# Altium project Tegra_Dual_Camera.PrjPcb (part 3 of 3)

## Sheet LWIR_FPGA_CSI.SchDoc
size A4
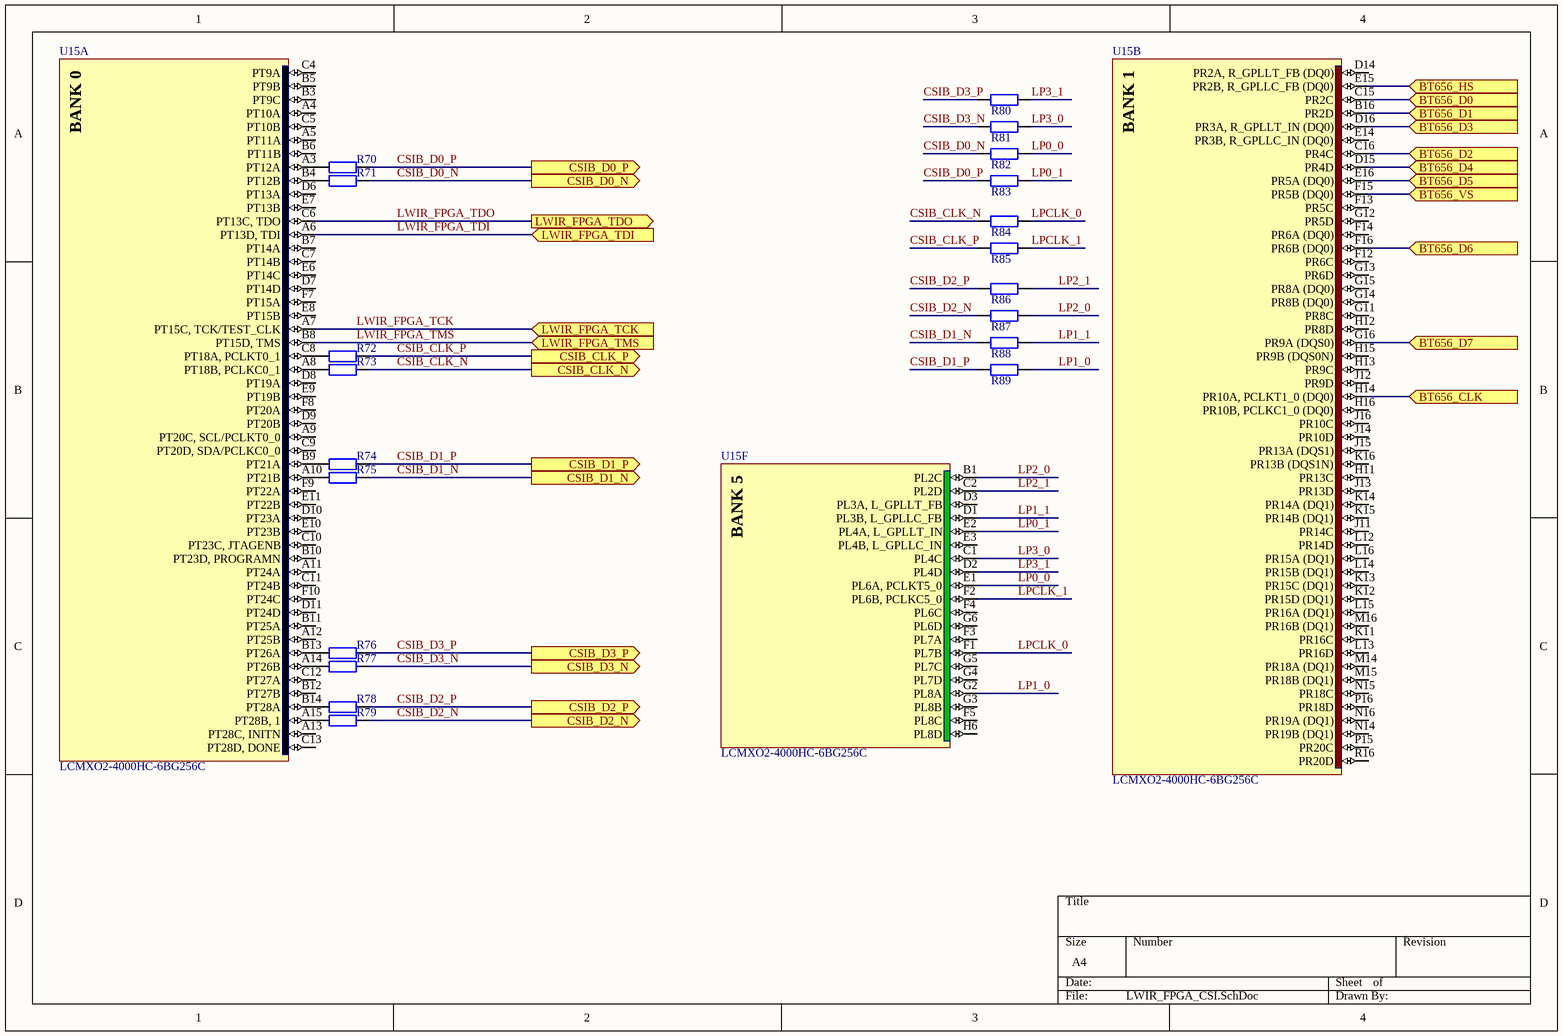
[diagram p10: LWIR_FPGA_CSI.SchDoc]

### Parts
R70  CRCW0402330RFKED  [0402R_M]  (value not drawn)
R71  CRCW0402330RFKED  [0402R_M]  (value not drawn)
R72  CRCW0402330RFKED  [0402R_M]  (value not drawn)
R73  CRCW0402330RFKED  [0402R_M]  (value not drawn)
R74  CRCW0402330RFKED  [0402R_M]  (value not drawn)
R75  CRCW0402330RFKED  [0402R_M]  (value not drawn)
R76  CRCW0402330RFKED  [0402R_M]  (value not drawn)
R77  CRCW0402330RFKED  [0402R_M]  (value not drawn)
R78  CRCW0402330RFKED  [0402R_M]  (value not drawn)
R79  CRCW0402330RFKED  [0402R_M]  (value not drawn)
R80  CRCW040249R9FKED  [0402R_M]  (value not drawn)
R81  CRCW040249R9FKED  [0402R_M]  (value not drawn)
R82  CRCW040249R9FKED  [0402R_M]  (value not drawn)
R83  CRCW040249R9FKED  [0402R_M]  (value not drawn)
R84  CRCW040249R9FKED  [0402R_M]  (value not drawn)
R85  CRCW040249R9FKED  [0402R_M]  (value not drawn)
R86  CRCW040249R9FKED  [0402R_M]  (value not drawn)
R87  CRCW040249R9FKED  [0402R_M]  (value not drawn)
R88  CRCW040249R9FKED  [0402R_M]  (value not drawn)
R89  CRCW040249R9FKED  [0402R_M]  (value not drawn)
U15  LCMXO2-4000HC-6BG256C  [caBGA256]  (parts A,B,F of 8)

### Ports
BT656_CLK (in), BT656_D0 (in), BT656_D1 (in), BT656_D2 (in), BT656_D3 (in), BT656_D4 (in), BT656_D5 (in), BT656_D6 (in), BT656_D7 (in), BT656_HS (in), BT656_VS (in), CSIB_CLK_N (out), CSIB_CLK_P (out), CSIB_D0_N (out), CSIB_D0_P (out), CSIB_D1_N (out), CSIB_D1_P (out), CSIB_D2_N (out), CSIB_D2_P (out), CSIB_D3_N (out), CSIB_D3_P (out), LWIR_FPGA_TCK (in), LWIR_FPGA_TDI (in), LWIR_FPGA_TDO (out), LWIR_FPGA_TMS (in)

### Nets
BT656_CLK: U15.H14(PR10A,_PCLKT1_0_(DQ0)) ; port BT656_CLK
BT656_D0: U15.C15(PR2C) ; port BT656_D0
BT656_D1: U15.B16(PR2D) ; port BT656_D1
BT656_D2: U15.C16(PR4C) ; port BT656_D2
BT656_D3: U15.D16(PR3A,_R_GPLLT_IN_(DQ0)) ; port BT656_D3
BT656_D4: U15.D15(PR4D) ; port BT656_D4
BT656_D5: U15.E16(PR5A_(DQ0)) ; port BT656_D5
BT656_D6: U15.F16(PR6B_(DQ0)) ; port BT656_D6
BT656_D7: U15.G16(PR9A_(DQS0)) ; port BT656_D7
BT656_HS: U15.E15(PR2B,_R_GPLLC_FB_(DQ0)) ; port BT656_HS
BT656_VS: U15.F15(PR5B_(DQ0)) ; port BT656_VS
CSIB_CLK_N: R73.2 R84.1 ; port CSIB_CLK_N
CSIB_CLK_P: R72.2 R85.1 ; port CSIB_CLK_P
CSIB_D0_N: R71.2 R82.1 ; port CSIB_D0_N
CSIB_D0_P: R70.2 R83.1 ; port CSIB_D0_P
CSIB_D1_N: R75.2 R88.2 ; port CSIB_D1_N
CSIB_D1_P: R74.2 R89.2 ; port CSIB_D1_P
CSIB_D2_N: R79.2 R87.2 ; port CSIB_D2_N
CSIB_D2_P: R78.2 R86.2 ; port CSIB_D2_P
CSIB_D3_N: R77.2 R81.1 ; port CSIB_D3_N
CSIB_D3_P: R76.2 R80.1 ; port CSIB_D3_P
LP0_0: R82.2 U15.E1(PL6A,_PCLKT5_0)
LP0_1: R83.2 U15.E2(PL4A,_L_GPLLT_IN)
LP1_0: R89.1 U15.G2(PL8A)
LP1_1: R88.1 U15.D1(PL3B,_L_GPLLC_FB)
LP2_0: R87.1 U15.B1(PL2C)
LP2_1: R86.1 U15.C2(PL2D)
LP3_0: R81.2 U15.C1(PL4C)
LP3_1: R80.2 U15.D2(PL4D)
LPCLK_0: R84.2 U15.F1(PL7B)
LPCLK_1: R85.2 U15.F2(PL6B,_PCLKC5_0)
LWIR_FPGA_TCK: U15.A7(PT15C,_TCK/TEST_CLK) ; port LWIR_FPGA_TCK
LWIR_FPGA_TDI: U15.A6(PT13D,_TDI) ; port LWIR_FPGA_TDI
LWIR_FPGA_TDO: U15.C6(PT13C,_TDO) ; port LWIR_FPGA_TDO
LWIR_FPGA_TMS: U15.B8(PT15D,_TMS) ; port LWIR_FPGA_TMS
NetR70_1: R70.1 U15.A3(PT12A)
NetR71_1: R71.1 U15.B4(PT12B)
NetR72_1: R72.1 U15.C8(PT18A,_PCLKT0_1)
NetR73_1: R73.1 U15.A8(PT18B,_PCLKC0_1)
NetR74_1: R74.1 U15.B9(PT21A)
NetR75_1: R75.1 U15.A10(PT21B)
NetR76_1: R76.1 U15.B13(PT26A)
NetR77_1: R77.1 U15.A14(PT26B)
NetR78_1: R78.1 U15.B14(PT28A)
NetR79_1: R79.1 U15.A15(PT28B,_1)

Not connected (* = marked no-connect by the designer): U15 A4(PT10A) A5(PT11A) A9(PT20C,_SCL/PCLKT0_0) A11(PT24A) A12(PT25B) A13(PT28C,_INITN) B3(PT9C) B5(PT9B) B6(PT11B) B7(PT14A) B10(PT23D,_PROGRAMN) B11(PT25A) B12(PT27B) C4(PT9A) C5(PT10B) C7(PT14B) C9(PT20D,_SDA/PCLKC0_0) C10(PT23C,_JTAGENB) C11(PT24B) C12(PT27A) C13(PT28D,_DONE) D3(PL3A,_L_GPLLT_FB) D6(PT13A) D7(PT14D) D8(PT19A) D9(PT20B) D10(PT23A) D11(PT24D) D14(PR2A,_R_GPLLT_FB_(DQ0)) E3(PL4B,_L_GPLLC_IN) E6(PT14C) E7(PT13B) E8(PT15B) E9(PT19B) E10(PT23B) E11(PT22B) E14(PR3B,_R_GPLLC_IN_(DQ0)) F3(PL7A) F4(PL6C) F5(PL8C) F7(PT15A) F8(PT20A) F9(PT22A) F10(PT24C) F12(PR6C) F13(PR5C) F14(PR6A_(DQ0)) G3(PL8B) G4(PL7D) G5(PL7C) G6(PL6D) G11(PR8C) G12(PR5D) G13(PR6D) G14(PR8B_(DQ0)) G15(PR8A_(DQ0)) H6(PL8D) H11(PR13C) H12(PR8D) H13(PR9C) H15(PR9B_(DQS0N)) H16(PR10B,_PCLKC1_0_(DQ0)) J11(PR14C) J12(PR9D) J13(PR13D) J14(PR10D) J15(PR13A_(DQS1)) J16(PR10C) K11(PR16C) K12(PR15D_(DQ1)) K13(PR15C_(DQ1)) K14(PR14A_(DQ1)) K15(PR14B_(DQ1)) K16(PR13B_(DQS1N)) L12(PR14D) L13(PR16D) L14(PR15B_(DQ1)) L15(PR16A_(DQ1)) L16(PR15A_(DQ1)) M14(PR18A_(DQ1)) M15(PR18B_(DQ1)) M16(PR16B_(DQ1)) N14(PR19B_(DQ1)) N15(PR18C) N16(PR19A_(DQ1)) P15(PR20C) P16(PR18D) R16(PR20D)

### Notes on the sheet
- (in symbol CMP-0111-00181-1, part A) BANK 0
- (in symbol CMP-0111-00181-1, part B) BANK 1
- (in symbol CMP-0111-00181-1, part F) BANK 5

### Library data of the parts
R70-R79 = CRCW0402330RFKED: RES SMD 330 OHM 1% 1/16W 0402; Manufacturer: Vishay Dale; Power (Watts): 0.063W, 1/16W; Temperature Coefficient: ±100ppm/°C; Value: 330R; Supplier 1: Digi-Key; Manufacturer Part Number: CRCW0402330RFKED; RoHS: RoHS Compliant; Category: Resistors; Stock 1: 346239; Pricing 1: 1=0.1, 10=0.037, 100=0.0149, 1000=0.0067, 2500=0.00582, 5000=0.00481 (USD); Packaging: Cut Tape (CT); Part Status: Active; Tolerance: ±1%; Composition: Thick Film; Features: Automotive AEC-Q200; Operating Temperature: -55°C ~ 155°C; Package / Case: 0402 (1005 Metric); Supplier Device Package: 0402; Size / Dimension: 0.039" L x 0.020" W (1.00mm x 0.50mm); Height - Seated (Max): 0.016" (0.40mm); Failure Rate: -; ComponentLink1URL: http://www.vishay.com/docs/20035/dcrcwe3.pdf; ComponentLink1Description: http://www.vishay.com/docs/20035/dcrcwe3.pdf; Supplier Part Number 1: 541-330LCT-ND
R80-R89 = CRCW040249R9FKED: as R66 on sheet Rail_discharge; Supplier 1: Digi-Key; Manufacturer Part Number: CRCW040249R9FKED; RoHS: RoHS Compliant; Category: Resistors; Stock 1: 0; Pricing 1: 1=0.1, 10=0.037, 100=0.0149, 1000=0.0067, 2500=0.00582, 5000=0.00481 (USD); Packaging: Cut Tape (CT); Part Status: Active; Tolerance: ±1%; Composition: Thick Film; Features: Automotive AEC-Q200; Operating Temperature: -55°C ~ 155°C; Package / Case: 0402 (1005 Metric); Supplier Device Package: 0402; Size / Dimension: 0.039" L x 0.020" W (1.00mm x 0.50mm); Height - Seated (Max): 0.016" (0.40mm); Failure Rate: -; ComponentLink1URL: http://www.vishay.com/docs/20035/dcrcwe3.pdf; ComponentLink1Description: http://www.vishay.com/docs/20035/dcrcwe3.pdf; Supplier Part Number 1: 541-49.9LCT-ND
U15 = CMP-0111-00181-1: MachXO2 High Performance CPLD with 4320 LUTs, Voltage Regulator, 2.5V/3.3V, 256-pin caBGA, Speed Grade-6, Commercial Grade, Halogen Free (RoHS); PackageDescription: 256-Ball caBGA Package, 14 x 14 mm Body, 0.8 mm Pitch; DatasheetVersion: ver01.0, Nov-2010; PackageReference: caBGA256; PackageVersion: ver02.6, Nov-2010; Code_JEDEC: MO-275-JJAB-2; PartId: 1

## Sheet LWIR_FPGA_Misc.SchDoc
size A4
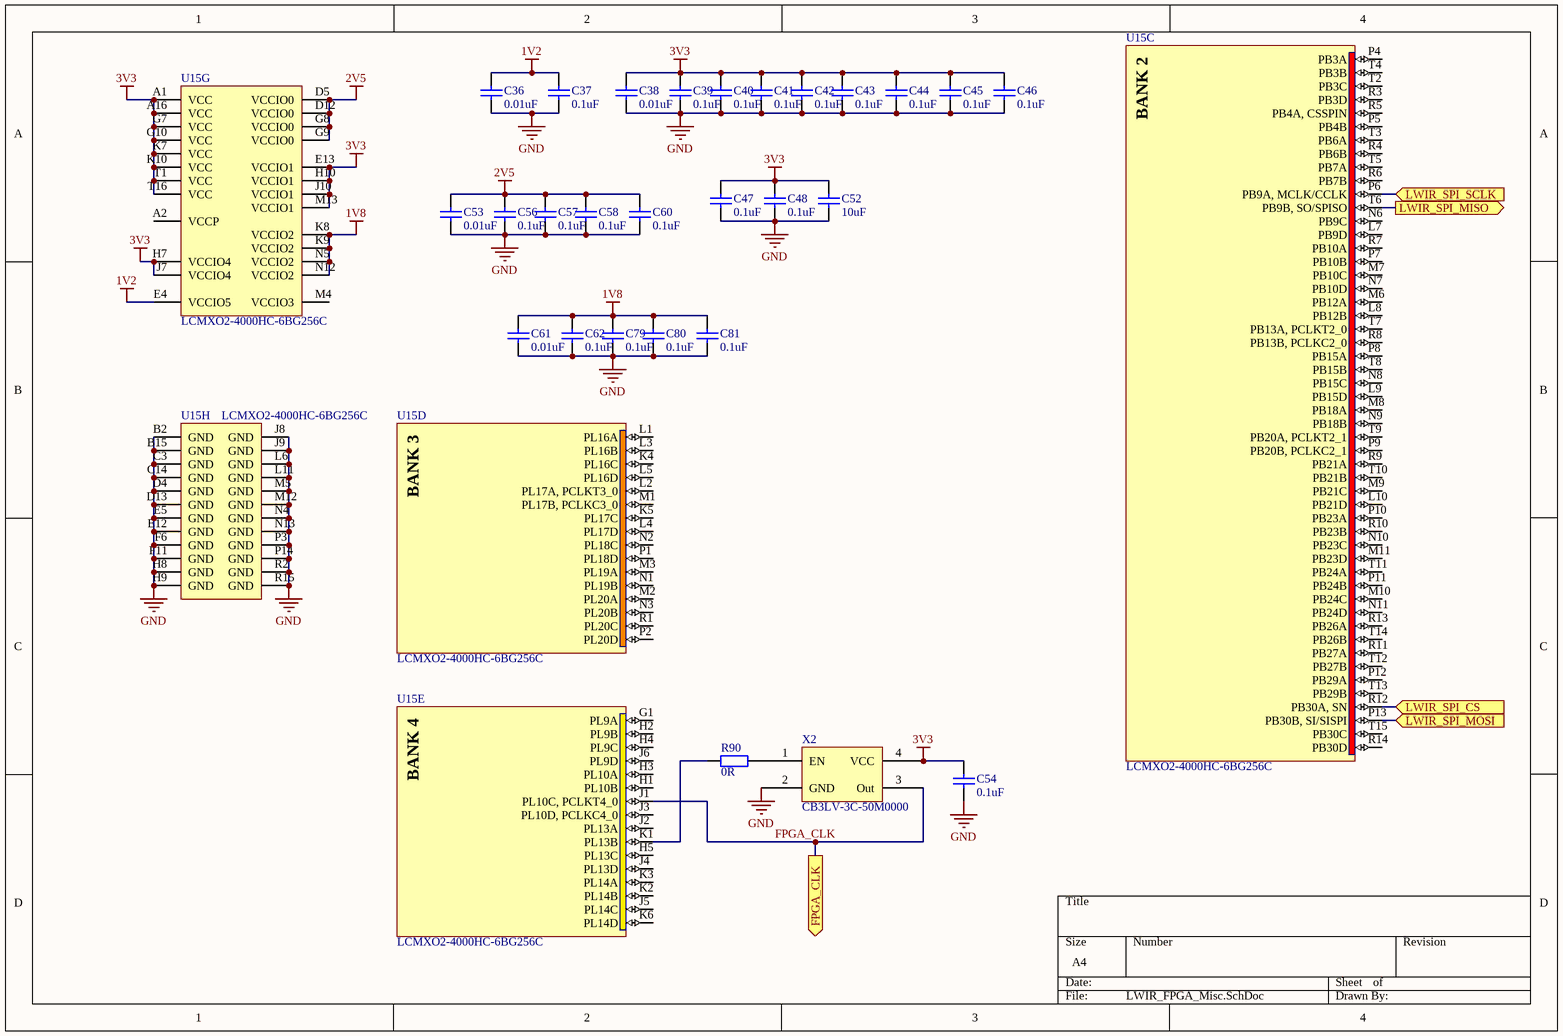
[diagram p11: LWIR_FPGA_Misc.SchDoc]

### Parts
C36  value 0.01uF  [0402C_M]  (hidden comment: GRM155R71H103KA88D)
C37  Capacitance: 0.1uF  [0402C_M]  (hidden comment: GRM155R71C104KA88D)
C38  value 0.01uF  [0402C_M]  (hidden comment: GRM155R71H103KA88D)
C39  Capacitance: 0.1uF  [0402C_M]  (hidden comment: GRM155R71C104KA88D)
C40  Capacitance: 0.1uF  [0402C_M]  (hidden comment: GRM155R71C104KA88D)
C41  Capacitance: 0.1uF  [0402C_M]  (hidden comment: GRM155R71C104KA88D)
C42  Capacitance: 0.1uF  [0402C_M]  (hidden comment: GRM155R71C104KA88D)
C43  Capacitance: 0.1uF  [0402C_M]  (hidden comment: GRM155R71C104KA88D)
C44  Capacitance: 0.1uF  [0402C_M]  (hidden comment: GRM155R71C104KA88D)
C45  Capacitance: 0.1uF  [0402C_M]  (hidden comment: GRM155R71C104KA88D)
C46  Capacitance: 0.1uF  [0402C_M]  (hidden comment: GRM155R71C104KA88D)
C47  Capacitance: 0.1uF  [0402C_M]  (hidden comment: GRM155R71C104KA88D)
C48  Capacitance: 0.1uF  [0402C_M]  (hidden comment: GRM155R71C104KA88D)
C52  value 10uF  [0603C_M]  (hidden comment: GRM188R60J106ME47D)
C53  value 0.01uF  [0402C_M]  (hidden comment: GRM155R71H103KA88D)
C54  Capacitance: 0.1uF  [0402C_M]  (hidden comment: GRM155R71C104KA88D)
C56  Capacitance: 0.1uF  [0402C_M]  (hidden comment: GRM155R71C104KA88D)
C57  Capacitance: 0.1uF  [0402C_M]  (hidden comment: GRM155R71C104KA88D)
C58  Capacitance: 0.1uF  [0402C_M]  (hidden comment: GRM155R71C104KA88D)
C60  Capacitance: 0.1uF  [0402C_M]  (hidden comment: GRM155R71C104KA88D)
C61  value 0.01uF  [0402C_M]  (hidden comment: GRM155R71H103KA88D)
C62  Capacitance: 0.1uF  [0402C_M]  (hidden comment: GRM155R71C104KA88D)
C79  Capacitance: 0.1uF  [0402C_M]  (hidden comment: GRM155R71C104KA88D)
C80  Capacitance: 0.1uF  [0402C_M]  (hidden comment: GRM155R71C104KA88D)
C81  Capacitance: 0.1uF  [0402C_M]  (hidden comment: GRM155R71C104KA88D)
R90  value 0R  [0402R_M]  (hidden comment: Generic resitor)
U15  LCMXO2-4000HC-6BG256C  [caBGA256]  (parts C,D,E,G,H of 8)
X2  CB3LV-3C-50M0000  [CB3LV-3C-50M0000]

### Ports
FPGA_CLK (out), LWIR_SPI_CS (in), LWIR_SPI_MISO (out), LWIR_SPI_MOSI (in), LWIR_SPI_SCLK (in)

### Nets
1V2: C36.2 C37.2 U15.E4(VCCIO5)
1V8: C61.2 C62.2 C79.2 C80.2 C81.2 U15.K8(VCCIO2) U15.K9(VCCIO2) U15.N5(VCCIO2) U15.N12(VCCIO2)
2V5: C53.2 C56.2 C57.2 C58.2 C60.2 U15.D5(VCCIO0) U15.D12(VCCIO0) U15.G8(VCCIO0) U15.G9(VCCIO0)
3V3: C38.2 C39.2 C40.2 C41.2 C42.2 C43.2 C44.2 C45.2 C46.2 C47.2 C48.2 C52.2 C54.2 U15.A1(VCC) U15.A16(VCC) U15.E13(VCCIO1) U15.G7(VCC) U15.G10(VCC) U15.H7(VCCIO4) U15.H10(VCCIO1) U15.J7(VCCIO4) U15.J10(VCCIO1) U15.K7(VCC) U15.K10(VCC) U15.M13(VCCIO1) U15.T1(VCC) U15.T16(VCC) X2.4(VCC)
GND: C36.1 C37.1 C38.1 C39.1 C40.1 C41.1 C42.1 C43.1 C44.1 C45.1 C46.1 C47.1 C48.1 C52.1 C53.1 C54.1 C56.1 C57.1 C58.1 C60.1 C61.1 C62.1 C79.1 C80.1 C81.1 U15.B2(GND) U15.B15(GND) U15.C3(GND) U15.C14(GND) U15.D4(GND) U15.D13(GND) U15.E5(GND) U15.E12(GND) U15.F6(GND) U15.F11(GND) U15.H8(GND) U15.H9(GND) U15.J8(GND) U15.J9(GND) U15.L6(GND) U15.L11(GND) U15.M5(GND) U15.M12(GND) U15.N4(GND) U15.N13(GND) U15.P3(GND) U15.P14(GND) U15.R2(GND) U15.R15(GND) X2.2(GND)
FPGA_CLK: U15.J1(PL10C,_PCLKT4_0) X2.3(Out) ; port FPGA_CLK
LWIR_SPI_CS: U15.R12(PB30A,_SN) ; port LWIR_SPI_CS
LWIR_SPI_MISO: U15.T6(PB9B,_SO/SPISO) ; port LWIR_SPI_MISO
LWIR_SPI_MOSI: U15.P13(PB30B,_SI/SISPI) ; port LWIR_SPI_MOSI
LWIR_SPI_SCLK: U15.P6(PB9A,_MCLK/CCLK) ; port LWIR_SPI_SCLK
NetR90_1: R90.1 U15.K1(PL13B)
NetR90_2: R90.2 X2.1(EN)

Not connected (* = marked no-connect by the designer): U15 A2(VCCP) G1(PL9A) H1(PL10B) H2(PL9B) H3(PL10A) H4(PL9C) H5(PL13C) J2(PL13A) J3(PL10D,_PCLKC4_0) J4(PL13D) J5(PL14C) J6(PL9D) K2(PL14B) K3(PL14A) K4(PL16C) K5(PL17C) K6(PL14D) L1(PL16A) L2(PL17A,_PCLKT3_0) L3(PL16B) L4(PL17D) L5(PL16D) L7(PB9D) L8(PB12B) L9(PB15D) L10(PB21D) M1(PL17B,_PCLKC3_0) M2(PL20A) M3(PL19A) M4(VCCIO3) M6(PB12A) M7(PB10C) M8(PB18A) M9(PB21C) M10(PB24C) M11(PB23D) N1(PL19B) N2(PL18C) N3(PL20B) N6(PB9C) N7(PB10D) N8(PB15C) N9(PB18B) N10(PB23C) N11(PB24D) P1(PL18D) P2(PL20D) P4(PB3A) P5(PB4B) P7(PB10B) P8(PB15A) P9(PB20B,_PCLKC2_1) P10(PB23A) P11(PB24B) P12(PB29A) R1(PL20C) R3(PB3D) R4(PB6B) R5(PB4A,_CSSPIN) R6(PB7B) R7(PB10A) R8(PB13B,_PCLKC2_0) R9(PB21A) R10(PB23B) R11(PB27A) R13(PB26A) R14(PB30D) T2(PB3C) T3(PB6A) T4(PB3B) T5(PB7A) T7(PB13A,_PCLKT2_0) T8(PB15B) T9(PB20A,_PCLKT2_1) T10(PB21B) T11(PB24A) T12(PB27B) T13(PB29B) T14(PB26B) T15(PB30C)

### Notes on the sheet
- (in symbol CMP-0111-00181-1, part C) BANK 2
- (in symbol CMP-0111-00181-1, part D) BANK 3
- (in symbol CMP-0111-00181-1, part E) BANK 4

### Library data of the parts
C36 C38 C53 C61 = GRM155R71H103KA88D: as C2 on sheet Ethernet; Supplier 1: Digi-Key; Manufacturer Part Number: GRM155R71H103KA88D; RoHS: RoHS Compliant; Category: Capacitors; Stock 1: 10436079; Pricing 1: 1=0.1, 10=0.011, 100=0.005, 500=0.00354, 1000=0.00278, 2500=0.00253, 5000=0.00233 (USD); Packaging: Cut Tape (CT); Part Status: Active; Voltage - Rated: 50V; Temperature Coefficient: X7R; Operating Temperature: -55°C ~ 125°C; Features: -; Ratings: -; Applications: General Purpose; Mounting Type: Surface Mount, MLCC; Package / Case: 0402 (1005 Metric); Size / Dimension: 0.039" L x 0.020" W (1.00mm x 0.50mm); Height - Seated (Max): -; Thickness (Max): 0.022" (0.55mm); Lead Spacing: -; Lead Style: -; ComponentLink1URL: http://www.murata.com/~/media/webrenewal/support/library/catalog/products/capacitor/mlcc/c02e.pdf; ComponentLink1Description: http://www.murata.com/~/media/webrenewal/support/library/catalog/products/capacitor/mlcc/c02e.pdf; Supplier Part Number 1: 490-4516-1-ND
C37 C39-C48 C54 C56-C58 C60 C62 C79-C81 = GRM155R71C104KA88D: as C19 on sheet SD_Card; Supplier 1: Digi-Key; Manufacturer Part Number: GRM155R71C104KA88D; RoHS: RoHS Compliant; Category: Capacitors; Stock 1: 58190082; Pricing 1: 1=0.1, 10=0.013, 100=0.0059, 500=0.00422, 1000=0.00332, 2500=0.00302, 5000=0.00278 (USD); Packaging: Cut Tape (CT); Part Status: Active; Voltage - Rated: 16V; Temperature Coefficient: X7R; Operating Temperature: -55°C ~ 125°C; Features: -; Ratings: -; Applications: General Purpose; Mounting Type: Surface Mount, MLCC; Package / Case: 0402 (1005 Metric); Size / Dimension: 0.039" L x 0.020" W (1.00mm x 0.50mm); Height - Seated (Max): -; Thickness (Max): 0.022" (0.55mm); Lead Spacing: -; Lead Style: -; ComponentLink1URL: http://www.murata.com/~/media/webrenewal/support/library/catalog/products/capacitor/mlcc/c02e.ashx; ComponentLink1Description: http://www.murata.com/~/media/webrenewal/support/library/catalog/products/capacitor/mlcc/c02e.ashx; Supplier Part Number 1: 490-3261-1-ND
C52 = GRM188R60J106ME47D: as C4 on sheet Power; Supplier 1: Digi-Key; Manufacturer Part Number: GRM188R60J106ME47D; RoHS: RoHS Compliant; Category: Capacitors; Stock 1: 13697850; Pricing 1: 1=0.17, 10=0.123, 100=0.0578, 500=0.04052, 1000=0.03355 (USD); Packaging: Cut Tape (CT); Part Status: Active; Voltage - Rated: 6.3V; Temperature Coefficient: X5R; Operating Temperature: -55°C ~ 85°C; Features: -; Ratings: -; Applications: General Purpose; Mounting Type: Surface Mount, MLCC; Package / Case: 0603 (1608 Metric); Size / Dimension: 0.063" L x 0.031" W (1.60mm x 0.80mm); Height - Seated (Max): -; Thickness (Max): 0.035" (0.90mm); Lead Spacing: -; Lead Style: -; ComponentLink1URL: http://www.murata.com/~/media/webrenewal/support/library/catalog/products/capacitor/mlcc/c02e.pdf; ComponentLink1Description: http://www.murata.com/~/media/webrenewal/support/library/catalog/products/capacitor/mlcc/c02e.pdf; Supplier Part Number 1: 490-3896-1-ND
R90 = Resistor
U15 = CMP-0111-00181-1: as U15 on sheet LWIR_FPGA_CSI; PackageDescription: 256-Ball caBGA Package, 14 x 14 mm Body, 0.8 mm Pitch; DatasheetVersion: ver01.0, Nov-2010; PackageReference: caBGA256; PackageVersion: ver02.6, Nov-2010; Code_JEDEC: MO-275-JJAB-2; PartId: 1
X2 = CB3LV-3C-50M0000: OSC XO 50.000MHZ HCMOS TTL SMD; Manufacturer: CTS-Frequency Controls; Function: Enable/Disable; Output: HCMOS, TTL; Voltage - Supply: 3.3V; Frequency Stability: ±50ppm; Current - Supply (Max): 40mA; Current - Supply (Disable) (Max): 10µA; Supplier 1: Digi-Key; Manufacturer Part Number: CB3LV-3C-50M0000; RoHS: RoHS Compliant; Category: Crystals, Oscillators, Resonators; Stock 1: 20256; Pricing 1: 1=1.41, 10=1.35, 50=1.319, 100=1.1306, 500=1.09918 (USD); Packaging: Cut Tape (CT); Part Status: Active; Type: XO (Standard); Operating Temperature: -20°C ~ 70°C; Ratings: -; Mounting Type: Surface Mount; Package / Case: 4-SMD, No Lead; Size / Dimension: 0.276" L x 0.197" W (7.00mm x 5.00mm); Height - Seated (Max): 0.071" (1.80mm); ComponentLink1URL: http://www.ctscorp.com/wp-content/uploads/2015/11/008-0256-0.pdf; ComponentLink1Description: http://www.ctscorp.com/wp-content/uploads/2015/11/008-0256-0.pdf; Supplier Part Number 1: CTX283LVCT-ND

## Sheet RGB_Camera.SchDoc
size A4
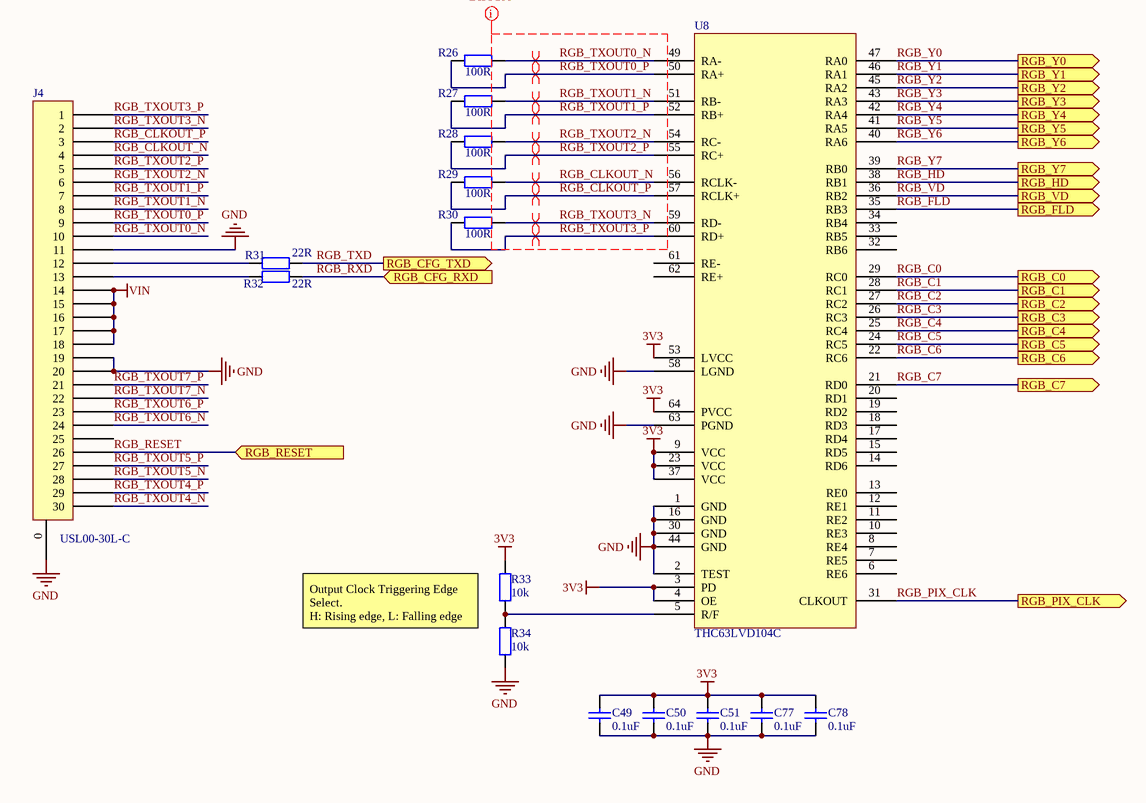
[diagram p12: RGB_Camera.SchDoc]

### Parts
C49  Capacitance: 0.1uF  [0402C_M]  (hidden comment: GRM155R71C104KA88D)
C50  Capacitance: 0.1uF  [0402C_M]  (hidden comment: GRM155R71C104KA88D)
C51  Capacitance: 0.1uF  [0402C_M]  (hidden comment: GRM155R71C104KA88D)
C77  Capacitance: 0.1uF  [0402C_M]  (hidden comment: GRM155R71C104KA88D)
C78  Capacitance: 0.1uF  [0402C_M]  (hidden comment: GRM155R71C104KA88D)
J4  USL00-30L-C  [USL00-30L-C]
R26  value 100R  [0402R_M]  (hidden comment: CRCW0402100RFKEE)
R27  value 100R  [0402R_M]  (hidden comment: CRCW0402100RFKEE)
R28  value 100R  [0402R_M]  (hidden comment: CRCW0402100RFKEE)
R29  value 100R  [0402R_M]  (hidden comment: CRCW0402100RFKEE)
R30  value 100R  [0402R_M]  (hidden comment: CRCW0402100RFKEE)
R31  Resistance: 22R  [0402R_M]  (hidden comment: CRCW040222R0JNED)
R32  Resistance: 22R  [0402R_M]  (hidden comment: CRCW040222R0JNED)
R33  value 10k  [0402R_M]  (hidden comment: CRCW040210K0FKED)
R34  value 10k  [0402R_M]  (hidden comment: CRCW040210K0FKED)
U8  THC63LVD104C  [THC_LQFP64_L]

### Ports
RGB_C0 (out), RGB_C1 (out), RGB_C2 (out), RGB_C3 (out), RGB_C4 (out), RGB_C5 (out), RGB_C6 (out), RGB_C7 (out), RGB_CFG_RXD (in), RGB_CFG_TXD (out), RGB_FLD (out), RGB_HD (out), RGB_PIX_CLK (out), RGB_RESET (in), RGB_VD (out), RGB_Y0 (out), RGB_Y1 (out), RGB_Y2 (out), RGB_Y3 (out), RGB_Y4 (out), RGB_Y5 (out), RGB_Y6 (out), RGB_Y7 (out)

### Nets
3V3: C49.2 C50.2 C51.2 C77.2 C78.2 R33.2 U8.3(PD) U8.4(OE) U8.9(VCC) U8.23(VCC) U8.37(VCC) U8.53(LVCC) U8.64(PVCC)
GND: C49.1 C50.1 C51.1 C77.1 C78.1 J4.0 J4.11 J4.19 J4.20 R34.1 U8.1(GND) U8.2(TEST) U8.16(GND) U8.30(GND) U8.44(GND) U8.58(LGND) U8.63(PGND)
VIN: J4.14 J4.15 J4.16 J4.17 J4.18
RGB_C0: U8.29(RC0) ; port RGB_C0
RGB_C1: U8.28(RC1) ; port RGB_C1
RGB_C2: U8.27(RC2) ; port RGB_C2
RGB_C3: U8.26(RC3) ; port RGB_C3
RGB_C4: U8.25(RC4) ; port RGB_C4
RGB_C5: U8.24(RC5) ; port RGB_C5
RGB_C6: U8.22(RC6) ; port RGB_C6
RGB_C7: U8.21(RD0) ; port RGB_C7
RGB_CLKOUT_N: J4.4 R29.2 U8.56(RCLK-)
RGB_CLKOUT_P: J4.3 R29.1 U8.57(RCLK+)
RGB_FLD: U8.35(RB3) ; port RGB_FLD
RGB_HD: U8.38(RB1) ; port RGB_HD
RGB_PIX_CLK: U8.31(CLKOUT) ; port RGB_PIX_CLK
RGB_RESET: J4.26 ; port RGB_RESET
RGB_RXD: R32.2 ; port RGB_CFG_RXD
RGB_TXD: R31.2 ; port RGB_CFG_TXD
RGB_TXOUT0_N: J4.10 R26.2 U8.49(RA-)
RGB_TXOUT0_P: J4.9 R26.1 U8.50(RA+)
RGB_TXOUT1_N: J4.8 R27.2 U8.51(RB-)
RGB_TXOUT1_P: J4.7 R27.1 U8.52(RB+)
RGB_TXOUT2_N: J4.6 R28.2 U8.54(RC-)
RGB_TXOUT2_P: J4.5 R28.1 U8.55(RC+)
RGB_TXOUT3_N: J4.2 R30.2 U8.59(RD-)
RGB_TXOUT3_P: J4.1 R30.1 U8.60(RD+)
RGB_TXOUT4_N: J4.30
RGB_TXOUT4_P: J4.29
RGB_TXOUT5_N: J4.28
RGB_TXOUT5_P: J4.27
RGB_TXOUT6_N: J4.24
RGB_TXOUT6_P: J4.23
RGB_TXOUT7_N: J4.22
RGB_TXOUT7_P: J4.21
RGB_VD: U8.36(RB2) ; port RGB_VD
RGB_Y0: U8.47(RA0) ; port RGB_Y0
RGB_Y1: U8.46(RA1) ; port RGB_Y1
RGB_Y2: U8.45(RA2) ; port RGB_Y2
RGB_Y3: U8.43(RA3) ; port RGB_Y3
RGB_Y4: U8.42(RA4) ; port RGB_Y4
RGB_Y5: U8.41(RA5) ; port RGB_Y5
RGB_Y6: U8.40(RA6) ; port RGB_Y6
RGB_Y7: U8.39(RB0) ; port RGB_Y7
NetJ4_12: J4.12 R31.1
NetJ4_13: J4.13 R32.1
NetR33_1: R33.1 R34.2 U8.5(R/F)

Not connected (* = marked no-connect by the designer): J4 25; U8 6(RE6) 7(RE5) 8(RE4) 10(RE3) 11(RE2) 12(RE1) 13(RE0) 14(RD6) 15(RD5) 17(RD4) 18(RD3) 19(RD2) 20(RD1) 32(RB6) 33(RB5) 34(RB4) 61(RE-) 62(RE+)

### Layout directives
differential pair: RGB_CLKOUT_N, RGB_CLKOUT_P, RGB_TXOUT0_N, RGB_TXOUT0_P, RGB_TXOUT1_N, RGB_TXOUT1_P, RGB_TXOUT2_N, RGB_TXOUT2_P, RGB_TXOUT3_N, RGB_TXOUT3_P
net class DIFF100: RGB_CLKOUT_N, RGB_CLKOUT_P, RGB_TXOUT0_N, RGB_TXOUT0_P, RGB_TXOUT1_N, RGB_TXOUT1_P, RGB_TXOUT2_N, RGB_TXOUT2_P, RGB_TXOUT3_N, RGB_TXOUT3_P

### Notes on the sheet
- Output Clock Triggering Edge Select.
  H: Rising edge, L: Falling edge

### Library data of the parts
C49-C51 C77 C78 = GRM155R71C104KA88D: as C19 on sheet SD_Card; Supplier 1: Digi-Key; Manufacturer Part Number: GRM155R71C104KA88D; RoHS: RoHS Compliant; Category: Capacitors; Stock 1: 58190082; Pricing 1: 1=0.1, 10=0.013, 100=0.0059, 500=0.00422, 1000=0.00332, 2500=0.00302, 5000=0.00278 (USD); Packaging: Cut Tape (CT); Part Status: Active; Voltage - Rated: 16V; Temperature Coefficient: X7R; Operating Temperature: -55°C ~ 125°C; Features: -; Ratings: -; Applications: General Purpose; Mounting Type: Surface Mount, MLCC; Package / Case: 0402 (1005 Metric); Size / Dimension: 0.039" L x 0.020" W (1.00mm x 0.50mm); Height - Seated (Max): -; Thickness (Max): 0.022" (0.55mm); Lead Spacing: -; Lead Style: -; ComponentLink1URL: http://www.murata.com/~/media/webrenewal/support/library/catalog/products/capacitor/mlcc/c02e.ashx; ComponentLink1Description: http://www.murata.com/~/media/webrenewal/support/library/catalog/products/capacitor/mlcc/c02e.ashx; Supplier Part Number 1: 490-3261-1-ND
R26-R30 = CRCW0402100RFKEE: RES SMD 100 OHM 1% 1/16W 0402; Manufacturer: Vishay Dale; Power (Watts): 0.063W, 1/16W; Temperature Coefficient: ±100ppm/°C; Supplier 1: Digi-Key; Manufacturer Part Number: CRCW0402100RFKEE; RoHS: RoHS Compliant; Category: Resistors; Stock 1: 2176; Pricing 1: 1=0.1, 10=0.037, 100=0.0149, 1000=0.0067, 2500=0.00582, 5000=0.00481 (USD); Packaging: Cut Tape (CT); Part Status: Active; Tolerance: ±1%; Composition: Thick Film; Features: Automotive AEC-Q200; Operating Temperature: -55°C ~ 155°C; Package / Case: 0402 (1005 Metric); Supplier Device Package: 0402; Size / Dimension: 0.039" L x 0.020" W (1.00mm x 0.50mm); Height - Seated (Max): 0.016" (0.40mm); Failure Rate: -; ComponentLink1URL: http://www.vishay.com/docs/20035/dcrcwe3.pdf; ComponentLink1Description: http://www.vishay.com/docs/20035/dcrcwe3.pdf; Supplier Part Number 1: 541-2953-1-ND
R31 R32 = CRCW040222R0JNED: RES SMD 22 OHM 5% 1/16W 0402; Manufacturer: Vishay / Dale; Power Rating: 63 mW; Temperature Coefficient: 200 PPM / K; Voltage Rating: 50 V; Unit Weight: 0.000023 oz; Supplier 1: Digi-Key; Manufacturer Part Number: CRCW040222R0JNED; Stock 1: 238592; Pricing 1: 1=0.1, 10=0.025, 100=0.01, 1000=0.0045, 2500=0.0039, 5000=0.0032 (USD); Product Category: Thick Film Resistors - SMD; RoHS: Details; Brand: Vishay / Dale; Tolerance: 5 %; Case Code - in: 0402; Case Code - mm: 1005; Operating Temperature Range: - 55 C to + 155 C; Series: CRCW; Height: 0.35 mm; Length: 1 mm; Package / Case: 0402 (1005 metric); Packaging: Reel; Product: Thick Film Resistors SMD; Factory Pack Quantity: 10000; Termination Style: SMD/SMT; Width: 0.5 mm; ComponentLink1URL: https://datasheet.ciiva.com/16429/dcrcwe3-16429946.pdf; ComponentLink1Description: https://datasheet.ciiva.com/16429/dcrcwe3-16429946.pdf; ComponentLink2URL: https://datasheet.ciiva.com/8882/dcrcwe3-8882922.pdf; ComponentLink2Description: https://datasheet.ciiva.com/8882/dcrcwe3-8882922.pdf; ComponentLink3URL: https://datasheet.ciiva.com/16770/70201119-16770509.pdf; ComponentLink3Description: https://datasheet.ciiva.com/16770/70201119-16770509.pdf; ComponentLink4URL: https://datasheet.ciiva.com/3256/dcrcwe3-3256251.pdf; ComponentLink4Description: https://datasheet.ciiva.com/3256/dcrcwe3-3256251.pdf; ComponentLink5URL: https://datasheet.ciiva.com/2462/dcrcwe3-2462055.pdf; ComponentLink5Description: https://datasheet.ciiva.com/2462/dcrcwe3-2462055.pdf; ComponentLink6URL: https://datasheet.ciiva.com/7743/dcrcwe3-7743525.pdf; ComponentLink6Description: https://datasheet.ciiva.com/7743/dcrcwe3-7743525.pdf; ComponentLink7URL: https://datasheet.ciiva.com/2462/dcrcwe3-2462057.pdf; ComponentLink7Description: https://datasheet.ciiva.com/2462/dcrcwe3-2462057.pdf; ComponentLink8URL: https://datasheet.ciiva.com/2462/dcrcwe3-2462056.pdf; ComponentLink8Description: https://datasheet.ciiva.com/2462/dcrcwe3-2462056.pdf; Supplier Part Number 1: 541-22JCT-ND
R33 R34 = CRCW040210K0FKED: RES SMD 10K OHM 1% 1/16W 0402; Manufacturer: Vishay Dale; Power (Watts): 0.063W, 1/16W; Temperature Coefficient: ±100ppm/°C; Supplier 1: Digi-Key; Manufacturer Part Number: CRCW040210K0FKED; RoHS: RoHS Compliant; Category: Resistors; Stock 1: 0; Pricing 1: 1=0.1, 10=0.037, 100=0.0149, 1000=0.0067, 2500=0.00582, 5000=0.00481 (USD); Packaging: Cut Tape (CT); Part Status: Active; Tolerance: ±1%; Composition: Thick Film; Features: Automotive AEC-Q200; Operating Temperature: -55°C ~ 155°C; Package / Case: 0402 (1005 Metric); Supplier Device Package: 0402; Size / Dimension: 0.039" L x 0.020" W (1.00mm x 0.50mm); Height - Seated (Max): 0.016" (0.40mm); Failure Rate: -; ComponentLink1URL: http://www.vishay.com/docs/20035/dcrcwe3.pdf; ComponentLink1Description: http://www.vishay.com/docs/20035/dcrcwe3.pdf; Supplier Part Number 1: 541-10.0KLCT-ND
U8 = THC63LVD104C: IC DESERIALIZER SNGL LVDS 64TQFP; Manufacturer: CEL; Data Rate: 784Mbps; Output Type: CMOS/TTL; Number of Inputs: 5; Number of Outputs: 35; Voltage - Supply: 3 V ~ 3.6 V; Supplier 1: Digi-Key; Manufacturer Part Number: THC63LVD104C; RoHS: RoHS Compliant; Category: Integrated Circuits (ICs); Stock 1: 1654; Pricing 1: 1=12.28, 10=11.048, 25=10.0656, 100=9.0835, 250=8.347, 500=7.6105, 1000=6.6285 (USD); Packaging: Tray; Part Status: Active; Function: Deserializer; Input Type: LVDS; Operating Temperature: -20°C ~ 85°C (TA); Mounting Type: Surface Mount; Package / Case: 64-TQFP; Supplier Device Package: 64-TQFP (10x10); ComponentLink1URL: http://www.cel.com/pdf/datasheets/THC63LVD104C.pdf; ComponentLink1Description: http://www.cel.com/pdf/datasheets/THC63LVD104C.pdf; Supplier Part Number 1: THC63LVD104C-ND

## Sheet RGB_FPGA_CSI.SchDoc
size A4
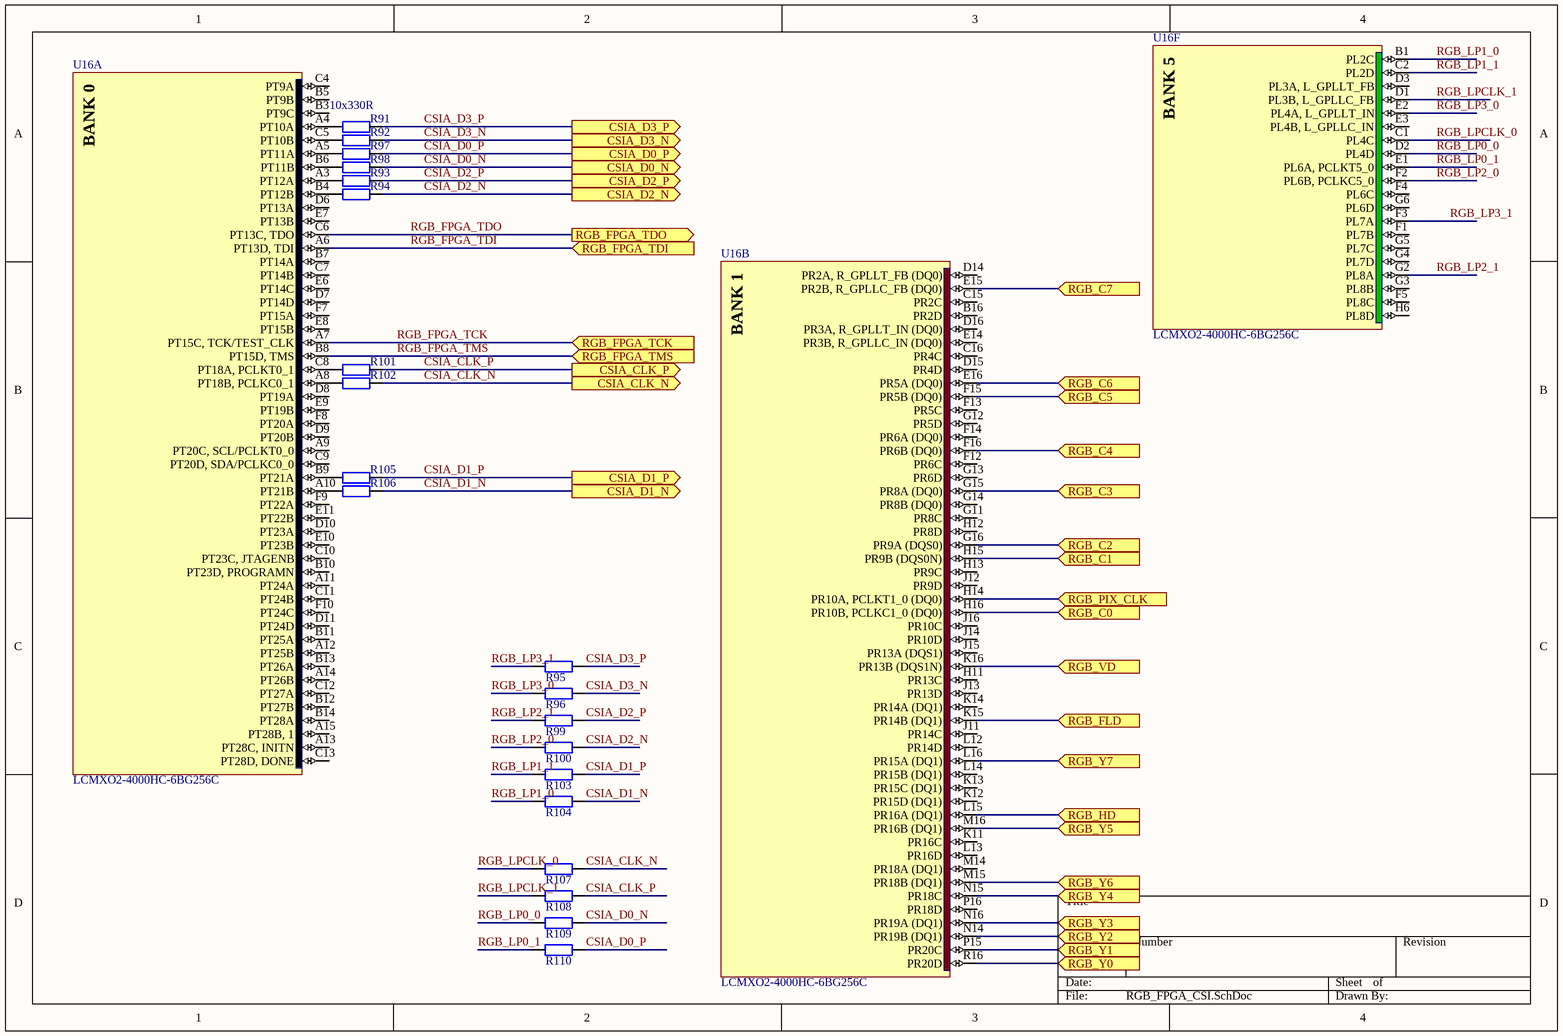
[diagram p13: RGB_FPGA_CSI.SchDoc]

### Parts
R91  CRCW0402330RFKED  [0402R_M]  (value not drawn)
R92  CRCW0402330RFKED  [0402R_M]  (value not drawn)
R93  CRCW0402330RFKED  [0402R_M]  (value not drawn)
R94  CRCW0402330RFKED  [0402R_M]  (value not drawn)
R95  CRCW040249R9FKED  [0402R_M]  (value not drawn)
R96  CRCW040249R9FKED  [0402R_M]  (value not drawn)
R97  CRCW0402330RFKED  [0402R_M]  (value not drawn)
R98  CRCW0402330RFKED  [0402R_M]  (value not drawn)
R99  CRCW040249R9FKED  [0402R_M]  (value not drawn)
R100  CRCW040249R9FKED  [0402R_M]  (value not drawn)
R101  CRCW0402330RFKED  [0402R_M]  (value not drawn)
R102  CRCW0402330RFKED  [0402R_M]  (value not drawn)
R103  CRCW040249R9FKED  [0402R_M]  (value not drawn)
R104  CRCW040249R9FKED  [0402R_M]  (value not drawn)
R105  CRCW0402330RFKED  [0402R_M]  (value not drawn)
R106  CRCW0402330RFKED  [0402R_M]  (value not drawn)
R107  CRCW040249R9FKED  [0402R_M]  (value not drawn)
R108  CRCW040249R9FKED  [0402R_M]  (value not drawn)
R109  CRCW040249R9FKED  [0402R_M]  (value not drawn)
R110  CRCW040249R9FKED  [0402R_M]  (value not drawn)
U16  LCMXO2-4000HC-6BG256C  [caBGA256]  (parts A,B,F of 8)

### Ports
CSIA_CLK_N (out), CSIA_CLK_P (out), CSIA_D0_N (out), CSIA_D0_P (out), CSIA_D1_N (out), CSIA_D1_P (out), CSIA_D2_N (out), CSIA_D2_P (out), CSIA_D3_N (out), CSIA_D3_P (out), RGB_C0 (in), RGB_C1 (in), RGB_C2 (in), RGB_C3 (in), RGB_C4 (in), RGB_C5 (in), RGB_C6 (in), RGB_C7 (in), RGB_FLD (in), RGB_FPGA_TCK (in), RGB_FPGA_TDI (in), RGB_FPGA_TDO (out), RGB_FPGA_TMS (in), RGB_HD (in), RGB_PIX_CLK (in), RGB_VD (in), RGB_Y0 (in), RGB_Y1 (in), RGB_Y2 (in), RGB_Y3 (in), RGB_Y4 (in), RGB_Y5 (in), RGB_Y6 (in), RGB_Y7 (in)

### Nets
CSIA_CLK_N: R102.2 R107.2 ; port CSIA_CLK_N
CSIA_CLK_P: R101.2 R108.2 ; port CSIA_CLK_P
CSIA_D0_N: R98.2 R109.2 ; port CSIA_D0_N
CSIA_D0_P: R97.2 R110.2 ; port CSIA_D0_P
CSIA_D1_N: R104.1 R106.2 ; port CSIA_D1_N
CSIA_D1_P: R103.1 R105.2 ; port CSIA_D1_P
CSIA_D2_N: R94.2 R100.1 ; port CSIA_D2_N
CSIA_D2_P: R93.2 R99.1 ; port CSIA_D2_P
CSIA_D3_N: R92.2 R96.1 ; port CSIA_D3_N
CSIA_D3_P: R91.2 R95.1 ; port CSIA_D3_P
RGB_C0: U16.H16(PR10B,_PCLKC1_0_(DQ0)) ; port RGB_C0
RGB_C1: U16.H15(PR9B_(DQS0N)) ; port RGB_C1
RGB_C2: U16.G16(PR9A_(DQS0)) ; port RGB_C2
RGB_C3: U16.G15(PR8A_(DQ0)) ; port RGB_C3
RGB_C4: U16.F16(PR6B_(DQ0)) ; port RGB_C4
RGB_C5: U16.F15(PR5B_(DQ0)) ; port RGB_C5
RGB_C6: U16.E16(PR5A_(DQ0)) ; port RGB_C6
RGB_C7: U16.E15(PR2B,_R_GPLLC_FB_(DQ0)) ; port RGB_C7
RGB_FLD: U16.K15(PR14B_(DQ1)) ; port RGB_FLD
RGB_FPGA_TCK: U16.A7(PT15C,_TCK/TEST_CLK) ; port RGB_FPGA_TCK
RGB_FPGA_TDI: U16.A6(PT13D,_TDI) ; port RGB_FPGA_TDI
RGB_FPGA_TDO: U16.C6(PT13C,_TDO) ; port RGB_FPGA_TDO
RGB_FPGA_TMS: U16.B8(PT15D,_TMS) ; port RGB_FPGA_TMS
RGB_HD: U16.L15(PR16A_(DQ1)) ; port RGB_HD
RGB_LP0_0: R109.1 U16.D2(PL4D)
RGB_LP0_1: R110.1 U16.E1(PL6A,_PCLKT5_0)
RGB_LP1_0: R104.2 U16.B1(PL2C)
RGB_LP1_1: R103.2 U16.C2(PL2D)
RGB_LP2_0: R100.2 U16.F2(PL6B,_PCLKC5_0)
RGB_LP2_1: R99.2 U16.G2(PL8A)
RGB_LP3_0: R96.2 U16.E2(PL4A,_L_GPLLT_IN)
RGB_LP3_1: R95.2 U16.F3(PL7A)
RGB_LPCLK_0: R107.1 U16.C1(PL4C)
RGB_LPCLK_1: R108.1 U16.D1(PL3B,_L_GPLLC_FB)
RGB_PIX_CLK: U16.H14(PR10A,_PCLKT1_0_(DQ0)) ; port RGB_PIX_CLK
RGB_VD: U16.K16(PR13B_(DQS1N)) ; port RGB_VD
RGB_Y0: U16.R16(PR20D) ; port RGB_Y0
RGB_Y1: U16.P15(PR20C) ; port RGB_Y1
RGB_Y2: U16.N14(PR19B_(DQ1)) ; port RGB_Y2
RGB_Y3: U16.N16(PR19A_(DQ1)) ; port RGB_Y3
RGB_Y4: U16.N15(PR18C) ; port RGB_Y4
RGB_Y5: U16.M16(PR16B_(DQ1)) ; port RGB_Y5
RGB_Y6: U16.M15(PR18B_(DQ1)) ; port RGB_Y6
RGB_Y7: U16.L16(PR15A_(DQ1)) ; port RGB_Y7
NetR91_1: R91.1 U16.A4(PT10A)
NetR92_1: R92.1 U16.C5(PT10B)
NetR93_1: R93.1 U16.A3(PT12A)
NetR94_1: R94.1 U16.B4(PT12B)
NetR97_1: R97.1 U16.A5(PT11A)
NetR98_1: R98.1 U16.B6(PT11B)
NetR101_1: R101.1 U16.C8(PT18A,_PCLKT0_1)
NetR102_1: R102.1 U16.A8(PT18B,_PCLKC0_1)
NetR105_1: R105.1 U16.B9(PT21A)
NetR106_1: R106.1 U16.A10(PT21B)

Not connected (* = marked no-connect by the designer): U16 A9(PT20C,_SCL/PCLKT0_0) A11(PT24A) A12(PT25B) A13(PT28C,_INITN) A14(PT26B) A15(PT28B,_1) B3(PT9C) B5(PT9B) B7(PT14A) B10(PT23D,_PROGRAMN) B11(PT25A) B12(PT27B) B13(PT26A) B14(PT28A) B16(PR2D) C4(PT9A) C7(PT14B) C9(PT20D,_SDA/PCLKC0_0) C10(PT23C,_JTAGENB) C11(PT24B) C12(PT27A) C13(PT28D,_DONE) C15(PR2C) C16(PR4C) D3(PL3A,_L_GPLLT_FB) D6(PT13A) D7(PT14D) D8(PT19A) D9(PT20B) D10(PT23A) D11(PT24D) D14(PR2A,_R_GPLLT_FB_(DQ0)) D15(PR4D) D16(PR3A,_R_GPLLT_IN_(DQ0)) E3(PL4B,_L_GPLLC_IN) E6(PT14C) E7(PT13B) E8(PT15B) E9(PT19B) E10(PT23B) E11(PT22B) E14(PR3B,_R_GPLLC_IN_(DQ0)) F1(PL7B) F4(PL6C) F5(PL8C) F7(PT15A) F8(PT20A) F9(PT22A) F10(PT24C) F12(PR6C) F13(PR5C) F14(PR6A_(DQ0)) G3(PL8B) G4(PL7D) G5(PL7C) G6(PL6D) G11(PR8C) G12(PR5D) G13(PR6D) G14(PR8B_(DQ0)) H6(PL8D) H11(PR13C) H12(PR8D) H13(PR9C) J11(PR14C) J12(PR9D) J13(PR13D) J14(PR10D) J15(PR13A_(DQS1)) J16(PR10C) K11(PR16C) K12(PR15D_(DQ1)) K13(PR15C_(DQ1)) K14(PR14A_(DQ1)) L12(PR14D) L13(PR16D) L14(PR15B_(DQ1)) M14(PR18A_(DQ1)) P16(PR18D)

### Notes on the sheet
- (near R91) 10x330R
- (in symbol CMP-0111-00181-1, part A) BANK 0
- (in symbol CMP-0111-00181-1, part B) BANK 1
- (in symbol CMP-0111-00181-1, part F) BANK 5

### Library data of the parts
R91-R94 R97 R98 R101 R102 R105 R106 = CRCW0402330RFKED: RES SMD 330 OHM 1% 1/16W 0402; Manufacturer: Vishay Dale; Power (Watts): 0.063W, 1/16W; Temperature Coefficient: ±100ppm/°C; Value: 330R; Supplier 1: Digi-Key; Manufacturer Part Number: CRCW0402330RFKED; RoHS: RoHS Compliant; Category: Resistors; Stock 1: 346239; Pricing 1: 1=0.1, 10=0.037, 100=0.0149, 1000=0.0067, 2500=0.00582, 5000=0.00481 (USD); Packaging: Cut Tape (CT); Part Status: Active; Tolerance: ±1%; Composition: Thick Film; Features: Automotive AEC-Q200; Operating Temperature: -55°C ~ 155°C; Package / Case: 0402 (1005 Metric); Supplier Device Package: 0402; Size / Dimension: 0.039" L x 0.020" W (1.00mm x 0.50mm); Height - Seated (Max): 0.016" (0.40mm); Failure Rate: -; ComponentLink1URL: http://www.vishay.com/docs/20035/dcrcwe3.pdf; ComponentLink1Description: http://www.vishay.com/docs/20035/dcrcwe3.pdf; Supplier Part Number 1: 541-330LCT-ND
R95 R96 R99 R100 R103 R104 R107-R110 = CRCW040249R9FKED: RES SMD 49.9 OHM 1% 1/16W 0402; Manufacturer: Vishay Dale; Power (Watts): 0.063W, 1/16W; Temperature Coefficient: ±100ppm/°C; Supplier 1: Digi-Key; Manufacturer Part Number: CRCW040249R9FKED; RoHS: RoHS Compliant; Category: Resistors; Stock 1: 0; Pricing 1: 1=0.1, 10=0.037, 100=0.0149, 1000=0.0067, 2500=0.00582, 5000=0.00481 (USD); Packaging: Cut Tape (CT); Part Status: Active; Tolerance: ±1%; Composition: Thick Film; Features: Automotive AEC-Q200; Operating Temperature: -55°C ~ 155°C; Package / Case: 0402 (1005 Metric); Supplier Device Package: 0402; Size / Dimension: 0.039" L x 0.020" W (1.00mm x 0.50mm); Height - Seated (Max): 0.016" (0.40mm); Failure Rate: -; ComponentLink1URL: http://www.vishay.com/docs/20035/dcrcwe3.pdf; ComponentLink1Description: http://www.vishay.com/docs/20035/dcrcwe3.pdf; Supplier Part Number 1: 541-49.9LCT-ND
U16 = CMP-0111-00181-1: MachXO2 High Performance CPLD with 4320 LUTs, Voltage Regulator, 2.5V/3.3V, 256-pin caBGA, Speed Grade-6, Commercial Grade, Halogen Free (RoHS); PackageDescription: 256-Ball caBGA Package, 14 x 14 mm Body, 0.8 mm Pitch; DatasheetVersion: ver01.0, Nov-2010; PackageReference: caBGA256; PackageVersion: ver02.6, Nov-2010; Code_JEDEC: MO-275-JJAB-2; PartId: 1

## Sheet RGB_FPGA_Misc.SchDoc
size A4
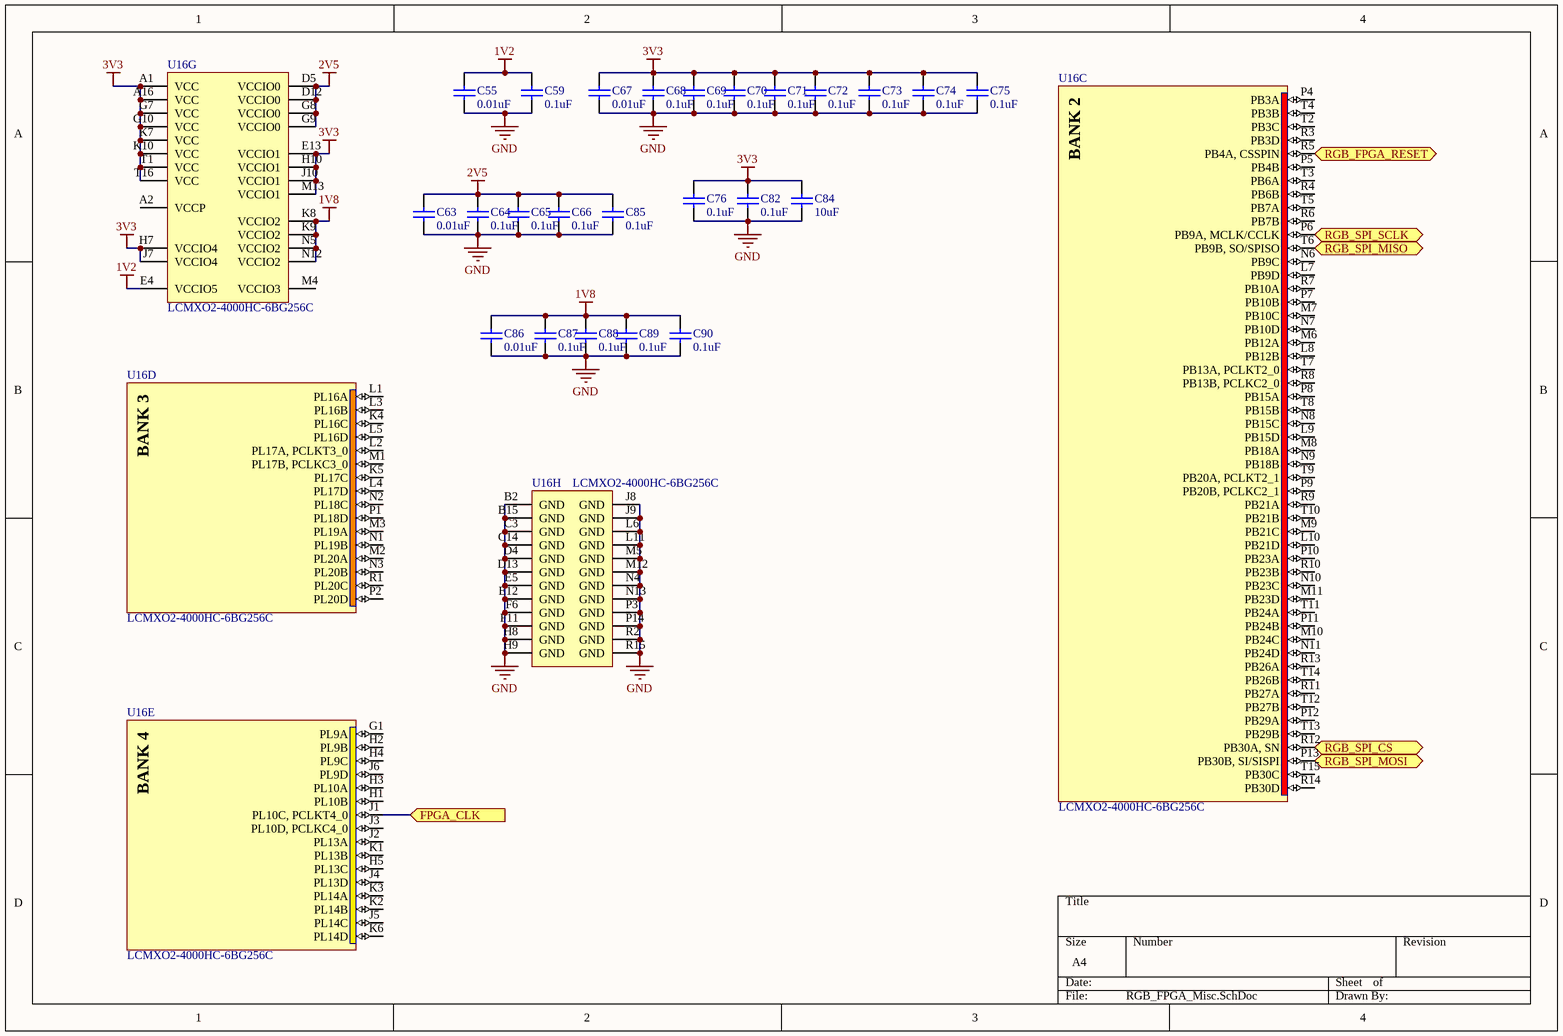
[diagram p14: RGB_FPGA_Misc.SchDoc]

### Parts
C55  value 0.01uF  [0402C_M]  (hidden comment: GRM155R71H103KA88D)
C59  Capacitance: 0.1uF  [0402C_M]  (hidden comment: GRM155R71C104KA88D)
C63  value 0.01uF  [0402C_M]  (hidden comment: GRM155R71H103KA88D)
C64  Capacitance: 0.1uF  [0402C_M]  (hidden comment: GRM155R71C104KA88D)
C65  Capacitance: 0.1uF  [0402C_M]  (hidden comment: GRM155R71C104KA88D)
C66  Capacitance: 0.1uF  [0402C_M]  (hidden comment: GRM155R71C104KA88D)
C67  value 0.01uF  [0402C_M]  (hidden comment: GRM155R71H103KA88D)
C68  Capacitance: 0.1uF  [0402C_M]  (hidden comment: GRM155R71C104KA88D)
C69  Capacitance: 0.1uF  [0402C_M]  (hidden comment: GRM155R71C104KA88D)
C70  Capacitance: 0.1uF  [0402C_M]  (hidden comment: GRM155R71C104KA88D)
C71  Capacitance: 0.1uF  [0402C_M]  (hidden comment: GRM155R71C104KA88D)
C72  Capacitance: 0.1uF  [0402C_M]  (hidden comment: GRM155R71C104KA88D)
C73  Capacitance: 0.1uF  [0402C_M]  (hidden comment: GRM155R71C104KA88D)
C74  Capacitance: 0.1uF  [0402C_M]  (hidden comment: GRM155R71C104KA88D)
C75  Capacitance: 0.1uF  [0402C_M]  (hidden comment: GRM155R71C104KA88D)
C76  Capacitance: 0.1uF  [0402C_M]  (hidden comment: GRM155R71C104KA88D)
C82  Capacitance: 0.1uF  [0402C_M]  (hidden comment: GRM155R71C104KA88D)
C84  value 10uF  [0603C_M]  (hidden comment: GRM188R60J106ME47D)
C85  Capacitance: 0.1uF  [0402C_M]  (hidden comment: GRM155R71C104KA88D)
C86  value 0.01uF  [0402C_M]  (hidden comment: GRM155R71H103KA88D)
C87  Capacitance: 0.1uF  [0402C_M]  (hidden comment: GRM155R71C104KA88D)
C88  Capacitance: 0.1uF  [0402C_M]  (hidden comment: GRM155R71C104KA88D)
C89  Capacitance: 0.1uF  [0402C_M]  (hidden comment: GRM155R71C104KA88D)
C90  Capacitance: 0.1uF  [0402C_M]  (hidden comment: GRM155R71C104KA88D)
U16  LCMXO2-4000HC-6BG256C  [caBGA256]  (parts C,D,E,G,H of 8)

### Ports
FPGA_CLK (in), RGB_FPGA_RESET (in), RGB_SPI_CS (in), RGB_SPI_MISO (out), RGB_SPI_MOSI (in), RGB_SPI_SCLK (in)

### Nets
1V2: C55.2 C59.2 U16.E4(VCCIO5)
1V8: C86.2 C87.2 C88.2 C89.2 C90.2 U16.K8(VCCIO2) U16.K9(VCCIO2) U16.N5(VCCIO2) U16.N12(VCCIO2)
2V5: C63.2 C64.2 C65.2 C66.2 C85.2 U16.D5(VCCIO0) U16.D12(VCCIO0) U16.G8(VCCIO0) U16.G9(VCCIO0)
3V3: C67.2 C68.2 C69.2 C70.2 C71.2 C72.2 C73.2 C74.2 C75.2 C76.2 C82.2 C84.2 U16.A1(VCC) U16.A16(VCC) U16.E13(VCCIO1) U16.G7(VCC) U16.G10(VCC) U16.H7(VCCIO4) U16.H10(VCCIO1) U16.J7(VCCIO4) U16.J10(VCCIO1) U16.K7(VCC) U16.K10(VCC) U16.M13(VCCIO1) U16.T1(VCC) U16.T16(VCC)
GND: C55.1 C59.1 C63.1 C64.1 C65.1 C66.1 C67.1 C68.1 C69.1 C70.1 C71.1 C72.1 C73.1 C74.1 C75.1 C76.1 C82.1 C84.1 C85.1 C86.1 C87.1 C88.1 C89.1 C90.1 U16.B2(GND) U16.B15(GND) U16.C3(GND) U16.C14(GND) U16.D4(GND) U16.D13(GND) U16.E5(GND) U16.E12(GND) U16.F6(GND) U16.F11(GND) U16.H8(GND) U16.H9(GND) U16.J8(GND) U16.J9(GND) U16.L6(GND) U16.L11(GND) U16.M5(GND) U16.M12(GND) U16.N4(GND) U16.N13(GND) U16.P3(GND) U16.P14(GND) U16.R2(GND) U16.R15(GND)
FPGA_CLK: U16.J1(PL10C,_PCLKT4_0) ; port FPGA_CLK
RGB_SPI_CS: U16.R12(PB30A,_SN) ; port RGB_SPI_CS
RGB_SPI_MISO: U16.T6(PB9B,_SO/SPISO) ; port RGB_SPI_MISO
RGB_SPI_MOSI: U16.P13(PB30B,_SI/SISPI) ; port RGB_SPI_MOSI
RGB_SPI_SCLK: U16.P6(PB9A,_MCLK/CCLK) ; port RGB_SPI_SCLK
NetU16_R5: U16.R5(PB4A,_CSSPIN) ; port RGB_FPGA_RESET

Not connected (* = marked no-connect by the designer): U16 A2(VCCP) G1(PL9A) H1(PL10B) H2(PL9B) H3(PL10A) H4(PL9C) H5(PL13C) J2(PL13A) J3(PL10D,_PCLKC4_0) J4(PL13D) J5(PL14C) J6(PL9D) K1(PL13B) K2(PL14B) K3(PL14A) K4(PL16C) K5(PL17C) K6(PL14D) L1(PL16A) L2(PL17A,_PCLKT3_0) L3(PL16B) L4(PL17D) L5(PL16D) L7(PB9D) L8(PB12B) L9(PB15D) L10(PB21D) M1(PL17B,_PCLKC3_0) M2(PL20A) M3(PL19A) M4(VCCIO3) M6(PB12A) M7(PB10C) M8(PB18A) M9(PB21C) M10(PB24C) M11(PB23D) N1(PL19B) N2(PL18C) N3(PL20B) N6(PB9C) N7(PB10D) N8(PB15C) N9(PB18B) N10(PB23C) N11(PB24D) P1(PL18D) P2(PL20D) P4(PB3A) P5(PB4B) P7(PB10B) P8(PB15A) P9(PB20B,_PCLKC2_1) P10(PB23A) P11(PB24B) P12(PB29A) R1(PL20C) R3(PB3D) R4(PB6B) R6(PB7B) R7(PB10A) R8(PB13B,_PCLKC2_0) R9(PB21A) R10(PB23B) R11(PB27A) R13(PB26A) R14(PB30D) T2(PB3C) T3(PB6A) T4(PB3B) T5(PB7A) T7(PB13A,_PCLKT2_0) T8(PB15B) T9(PB20A,_PCLKT2_1) T10(PB21B) T11(PB24A) T12(PB27B) T13(PB29B) T14(PB26B) T15(PB30C)

### Notes on the sheet
- (in symbol CMP-0111-00181-1, part C) BANK 2
- (in symbol CMP-0111-00181-1, part D) BANK 3
- (in symbol CMP-0111-00181-1, part E) BANK 4

### Library data of the parts
C55 C63 C67 C86 = GRM155R71H103KA88D: CAP CER 0.01uF 50V X7R 0402; Manufacturer: Murata Electronics North America; Tolerance: ±10%; Supplier 1: Digi-Key; Manufacturer Part Number: GRM155R71H103KA88D; RoHS: RoHS Compliant; Category: Capacitors; Stock 1: 10436079; Pricing 1: 1=0.1, 10=0.011, 100=0.005, 500=0.00354, 1000=0.00278, 2500=0.00253, 5000=0.00233 (USD); Packaging: Cut Tape (CT); Part Status: Active; Voltage - Rated: 50V; Temperature Coefficient: X7R; Operating Temperature: -55°C ~ 125°C; Features: -; Ratings: -; Applications: General Purpose; Mounting Type: Surface Mount, MLCC; Package / Case: 0402 (1005 Metric); Size / Dimension: 0.039" L x 0.020" W (1.00mm x 0.50mm); Height - Seated (Max): -; Thickness (Max): 0.022" (0.55mm); Lead Spacing: -; Lead Style: -; ComponentLink1URL: http://www.murata.com/~/media/webrenewal/support/library/catalog/products/capacitor/mlcc/c02e.pdf; ComponentLink1Description: http://www.murata.com/~/media/webrenewal/support/library/catalog/products/capacitor/mlcc/c02e.pdf; Supplier Part Number 1: 490-4516-1-ND
C59 C64-C66 C68-C76 C82 C85 C87-C90 = GRM155R71C104KA88D: CAP CER 0.1UF 16V X7R 0402; Manufacturer: Murata Electronics North America; Tolerance: ±10%; Supplier 1: Digi-Key; Manufacturer Part Number: GRM155R71C104KA88D; RoHS: RoHS Compliant; Category: Capacitors; Stock 1: 58190082; Pricing 1: 1=0.1, 10=0.013, 100=0.0059, 500=0.00422, 1000=0.00332, 2500=0.00302, 5000=0.00278 (USD); Packaging: Cut Tape (CT); Part Status: Active; Voltage - Rated: 16V; Temperature Coefficient: X7R; Operating Temperature: -55°C ~ 125°C; Features: -; Ratings: -; Applications: General Purpose; Mounting Type: Surface Mount, MLCC; Package / Case: 0402 (1005 Metric); Size / Dimension: 0.039" L x 0.020" W (1.00mm x 0.50mm); Height - Seated (Max): -; Thickness (Max): 0.022" (0.55mm); Lead Spacing: -; Lead Style: -; ComponentLink1URL: http://www.murata.com/~/media/webrenewal/support/library/catalog/products/capacitor/mlcc/c02e.ashx; ComponentLink1Description: http://www.murata.com/~/media/webrenewal/support/library/catalog/products/capacitor/mlcc/c02e.ashx; Supplier Part Number 1: 490-3261-1-ND
C84 = GRM188R60J106ME47D: CAP CER 10UF 6.3V X5R 0603; Manufacturer: Murata Electronics North America; Tolerance: ±20%; Supplier 1: Digi-Key; Manufacturer Part Number: GRM188R60J106ME47D; RoHS: RoHS Compliant; Category: Capacitors; Stock 1: 13697850; Pricing 1: 1=0.17, 10=0.123, 100=0.0578, 500=0.04052, 1000=0.03355 (USD); Packaging: Cut Tape (CT); Part Status: Active; Voltage - Rated: 6.3V; Temperature Coefficient: X5R; Operating Temperature: -55°C ~ 85°C; Features: -; Ratings: -; Applications: General Purpose; Mounting Type: Surface Mount, MLCC; Package / Case: 0603 (1608 Metric); Size / Dimension: 0.063" L x 0.031" W (1.60mm x 0.80mm); Height - Seated (Max): -; Thickness (Max): 0.035" (0.90mm); Lead Spacing: -; Lead Style: -; ComponentLink1URL: http://www.murata.com/~/media/webrenewal/support/library/catalog/products/capacitor/mlcc/c02e.pdf; ComponentLink1Description: http://www.murata.com/~/media/webrenewal/support/library/catalog/products/capacitor/mlcc/c02e.pdf; Supplier Part Number 1: 490-3896-1-ND
U16 = CMP-0111-00181-1: as U16 on sheet RGB_FPGA_CSI; PackageDescription: 256-Ball caBGA Package, 14 x 14 mm Body, 0.8 mm Pitch; DatasheetVersion: ver01.0, Nov-2010; PackageReference: caBGA256; PackageVersion: ver02.6, Nov-2010; Code_JEDEC: MO-275-JJAB-2; PartId: 1

## Nets that join several sheets
1V2: Power (C7.2 R5.2 R6.2 U3.4), MCU_CAN (U11.15), Rail_discharge (R67.2), LWIR_FPGA_Misc (C36.2 C37.2 U15.E4), RGB_FPGA_Misc (C55.2 C59.2 U16.E4)
1V8: Power (C14.2 R16.2 R17.2 U6.4), Tegra_Serial (5 pins), MCU_CAN (U11.16), Rail_discharge (R66.2), LWIR_FPGA_Misc (9 pins), RGB_FPGA_Misc (9 pins)
2V5: Power (C12.2 R14.2 R15.2 U5.4), Rail_discharge (R64.2 R65.2), LWIR_FPGA_Misc (9 pins), RGB_FPGA_Misc (9 pins)
3V3: Power (C16.2 R22.2 R23.2 U7.4), SD_Card (C17.2 U9.1), Tegra_Serial (C1.2 U10.19), Rail_discharge (R62.2 R63.2), LWIR_FPGA_Misc (28 pins), RGB_Camera (13 pins), RGB_FPGA_Misc (26 pins)
3V3STB: Power (C4.2 U2.2), MCU_CAN (18 pins)
5V: Power (14 pins), USB (C31.2 C32.2 U14.1), Rail_discharge (R61.2), LWIR_Camera (R2.2 U1.1)
GND: Power (122 pins), Not_Used (10 pins), SD_Card (10 pins), Ethernet (C2.1 J2.0), Tegra_Serial (5 pins), MCU_CAN (24 pins), USB (14 pins), Rail_discharge (7 pins), LWIR_Camera (5 pins), LWIR_FPGA_Misc (50 pins), RGB_Camera (17 pins), RGB_FPGA_Misc (48 pins)
VIN: Power (13 pins), MCU_CAN (R53.2), RGB_Camera (5 pins)
1V2_EN: Power (R8.2 U3.1), MCU_CAN (U11.61)
1V8_EN: Power (R19.2 U6.1), MCU_CAN (U11.57)
2V5_EN: Power (R18.2 U5.1), MCU_CAN (U11.58)
2V5_PG: Power (R15.1 U5.3), MCU_CAN (U11.59)
3V3_EN: Power (R24.2 U7.1), MCU_CAN (U11.55)
3V3_PG: Power (R23.1 U7.3), MCU_CAN (U11.56)
5V_EN: Power (R12.2 U4.13), MCU_CAN (U11.35)
5V_PG: Power (R10.1 U4.4), MCU_CAN (U11.27)
BT656_CLK: LWIR_Camera (J3.4), LWIR_FPGA_CSI (U15.H14)
BT656_D0: LWIR_Camera (J3.6), LWIR_FPGA_CSI (U15.C15)
BT656_D1: LWIR_Camera (J3.8), LWIR_FPGA_CSI (U15.B16)
BT656_D2: LWIR_Camera (J3.10), LWIR_FPGA_CSI (U15.C16)
BT656_D3: LWIR_Camera (J3.12), LWIR_FPGA_CSI (U15.D16)
BT656_D4: LWIR_Camera (J3.14), LWIR_FPGA_CSI (U15.D15)
BT656_D5: LWIR_Camera (J3.16), LWIR_FPGA_CSI (U15.E16)
BT656_D6: LWIR_Camera (J3.18), LWIR_FPGA_CSI (U15.F16)
BT656_D7: LWIR_Camera (J3.20), LWIR_FPGA_CSI (U15.G16)
BT656_HS: LWIR_Camera (J3.17), LWIR_FPGA_CSI (U15.E15)
BT656_VS: LWIR_Camera (J3.19), LWIR_FPGA_CSI (U15.F15)
CARRIER_PWR_ON: Power (J1.A48), MCU_CAN (U11.26)
CSIA_CLK_N: Tegra_CSI (J1.G27), RGB_FPGA_CSI (R102.2 R107.2)
CSIA_CLK_P: Tegra_CSI (J1.G28), RGB_FPGA_CSI (R101.2 R108.2)
CSIA_D0_N: Tegra_CSI (J1.F28), RGB_FPGA_CSI (R98.2 R109.2)
CSIA_D0_P: Tegra_CSI (J1.F29), RGB_FPGA_CSI (R97.2 R110.2)
CSIA_D1_N: Tegra_CSI (J1.H26), RGB_FPGA_CSI (R104.1 R106.2)
CSIA_D1_P: Tegra_CSI (J1.H27), RGB_FPGA_CSI (R103.1 R105.2)
CSIA_D2_N: Tegra_CSI (J1.C28), RGB_FPGA_CSI (R94.2 R100.1)
CSIA_D2_P: Tegra_CSI (J1.C29), RGB_FPGA_CSI (R93.2 R99.1)
CSIA_D3_N: Tegra_CSI (J1.E26), RGB_FPGA_CSI (R92.2 R96.1)
CSIA_D3_P: Tegra_CSI (J1.E27), RGB_FPGA_CSI (R91.2 R95.1)
CSIB_CLK_N: Tegra_CSI (J1.G24), LWIR_FPGA_CSI (R73.2 R84.1)
CSIB_CLK_P: Tegra_CSI (J1.G25), LWIR_FPGA_CSI (R72.2 R85.1)
CSIB_D0_N: Tegra_CSI (J1.F25), LWIR_FPGA_CSI (R71.2 R82.1)
CSIB_D0_P: Tegra_CSI (J1.F26), LWIR_FPGA_CSI (R70.2 R83.1)
CSIB_D1_N: Tegra_CSI (J1.H23), LWIR_FPGA_CSI (R75.2 R88.2)
CSIB_D1_P: Tegra_CSI (J1.H24), LWIR_FPGA_CSI (R74.2 R89.2)
CSIB_D2_N: Tegra_CSI (J1.C25), LWIR_FPGA_CSI (R79.2 R87.2)
CSIB_D2_P: Tegra_CSI (J1.C26), LWIR_FPGA_CSI (R78.2 R86.2)
CSIB_D3_N: Tegra_CSI (J1.E23), LWIR_FPGA_CSI (R77.2 R81.1)
CSIB_D3_P: Tegra_CSI (J1.E24), LWIR_FPGA_CSI (R76.2 R80.1)
FORCE_RECOV#: Power (J1.E1 R7.2), MCU_CAN (U11.36)
FPGA_CLK: LWIR_FPGA_Misc (U15.J1 X2.3), RGB_FPGA_Misc (U16.J1)
LWIR_SPI_CS: Tegra_Serial (J1.F3 R51.2), LWIR_FPGA_Misc (U15.R12)
LWIR_SPI_MISO: Tegra_Serial (J1.E4), LWIR_FPGA_Misc (U15.T6)
LWIR_SPI_MOSI: Tegra_Serial (J1.F4), LWIR_FPGA_Misc (U15.P13)
LWIR_SPI_SCLK: Tegra_Serial (J1.E3), LWIR_FPGA_Misc (U15.P6)
NetR4_2: Power (R4.2), MCU_CAN (U11.8)
POWER_BTN#: Power (J1.B50), MCU_CAN (U11.24)
RAIL_DISCHARGE: MCU_CAN (U11.62), Rail_discharge (7 pins)
RESET_IN#: Power (J1.A47), MCU_CAN (U11.9)
RGB_C0: RGB_Camera (U8.29), RGB_FPGA_CSI (U16.H16)
RGB_C1: RGB_Camera (U8.28), RGB_FPGA_CSI (U16.H15)
RGB_C2: RGB_Camera (U8.27), RGB_FPGA_CSI (U16.G16)
RGB_C3: RGB_Camera (U8.26), RGB_FPGA_CSI (U16.G15)
RGB_C4: RGB_Camera (U8.25), RGB_FPGA_CSI (U16.F16)
RGB_C5: RGB_Camera (U8.24), RGB_FPGA_CSI (U16.F15)
RGB_C6: RGB_Camera (U8.22), RGB_FPGA_CSI (U16.E16)
RGB_C7: RGB_Camera (U8.21), RGB_FPGA_CSI (U16.E15)
RGB_FLD: RGB_Camera (U8.35), RGB_FPGA_CSI (U16.K15)
RGB_HD: RGB_Camera (U8.38), RGB_FPGA_CSI (U16.L15)
RGB_PIX_CLK: RGB_Camera (U8.31), RGB_FPGA_CSI (U16.H14)
RGB_RXD: MCU_CAN (U11.29), RGB_Camera (R32.2)
RGB_SPI_CS: Tegra_Serial (J1.E14 R52.2), RGB_FPGA_Misc (U16.R12)
RGB_SPI_MISO: Tegra_Serial (J1.F14), RGB_FPGA_Misc (U16.T6)
RGB_SPI_MOSI: Tegra_Serial (J1.F13), RGB_FPGA_Misc (U16.P13)
RGB_SPI_SCLK: Tegra_Serial (J1.G13), RGB_FPGA_Misc (U16.P6)
RGB_TXD: MCU_CAN (U11.30), RGB_Camera (R31.2)
RGB_VD: RGB_Camera (U8.36), RGB_FPGA_CSI (U16.K16)
RGB_Y0: RGB_Camera (U8.47), RGB_FPGA_CSI (U16.R16)
RGB_Y1: RGB_Camera (U8.46), RGB_FPGA_CSI (U16.P15)
RGB_Y2: RGB_Camera (U8.45), RGB_FPGA_CSI (U16.N14)
RGB_Y3: RGB_Camera (U8.43), RGB_FPGA_CSI (U16.N16)
RGB_Y4: RGB_Camera (U8.42), RGB_FPGA_CSI (U16.N15)
RGB_Y5: RGB_Camera (U8.41), RGB_FPGA_CSI (U16.M16)
RGB_Y6: RGB_Camera (U8.40), RGB_FPGA_CSI (U16.M15)
RGB_Y7: RGB_Camera (U8.39), RGB_FPGA_CSI (U16.L16)
SER_CON_OE: Tegra_Serial (R1.1 R50.2 U10.10), MCU_CAN (U11.53)
SLEEP#: Power (J1.E2), MCU_CAN (U11.37)
UART1_RX: Tegra_Serial (R46.2), MCU_CAN (R59.1), LWIR_Camera (J3.1)
UART1_TX: Tegra_Serial (R47.2), MCU_CAN (R57.1), LWIR_Camera (J3.2)
UART2_RX: Tegra_Serial (U10.12), MCU_CAN (R58.1 U11.42)
UART2_TX: Tegra_Serial (U10.13), MCU_CAN (R60.1 U11.43)
VIN_PWR_BAD#: Power (J1.B8 R3.2), MCU_CAN (U11.28)